# Altium project Controlador_Digital.PrjPcb
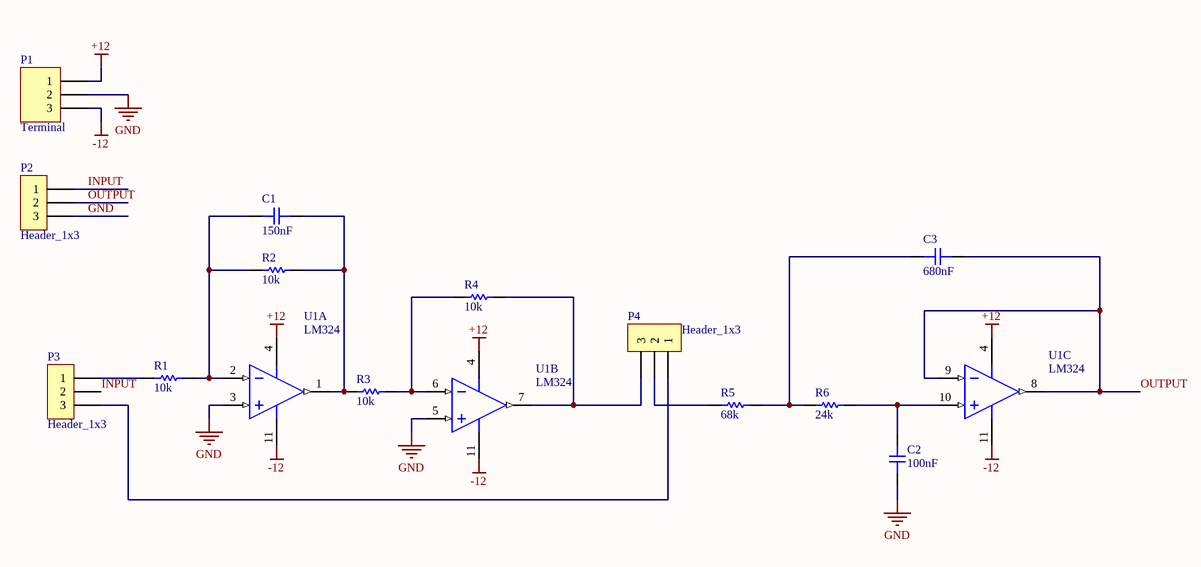
[diagram p0: Controlador_Digital.SchDoc]
1 sheet, 14 parts. Net scope: global (net labels, ports and power ports of the same name join across sheets).
Board file: Controlador_Digital.PcbDoc

## Sheet Controlador_Digital.SchDoc
size A4

### Parts
C1  150nF  [C200-350-150]
C2  100nF  [C300-450-150]
C3  680nF  [C400-550-150]
P1  Terminal  [KRE_3]
P2  Header_1x3  [HDR-M-1x3-2.54mm-180-9.2mm]
P3  Header_1x3  [HDR-M-1x3-2.54mm-180-9.2mm]
P4  Header_1x3  [HDR-M-1x3-2.54mm-180-9.2mm]
R1  10k  [R400-2.0mm]
R2  10k  [R400-2.0mm]
R3  10k  [R400-2.0mm]
R4  10k  [R400-2.0mm]
R5  68k  [R400-2.0mm]
R6  24k  [R400-2.0mm]
U1  LM324  [TI-N14]  (parts A,B,C of 4)

### Nets
+12: P1.1 U1.4(VCC+)
-12: P1.3 U1.11(VCC-)
GND: C2.1 P1.2 P2.3 U1.3(IN1+) U1.5(IN1+)
INPUT: P2.1 P3.2
OUTPUT: C3.1 P2.2 U1.8(OUT1) U1.9(IN1-)
NetC1_1: C1.1 R2.2 R3.1 U1.1(OUT1)
NetC1_2: C1.2 R1.2 R2.1 U1.2(IN1-)
NetC2_2: C2.2 R6.2 U1.10(IN1+)
NetC3_2: C3.2 R5.2 R6.1
NetP3_1: P3.1 R1.1
NetP3_3: P3.3 P4.1
NetP4_2: P4.2 R5.1
NetP4_3: P4.3 R4.2 U1.7(OUT1)
NetR3_2: R3.2 R4.1 U1.6(IN1-)

### Library data of the parts
C1-C3 = Capacitor: Voltage: 100 V; Published: 8-Jun-2000; LatestRevisionDate: 17-Jul-2002; LatestRevisionNote: Re-released for DXP Platform.; PackageReference: RAD-0.3; Publisher: Altium Limited
P1 = KRE_3: Terminal Block 1x3
P2-P4 = Header_1x3: Header, 1 Line, 3 Columns, 3 Pins; LatestRevisionDate: 17-Jul-2002; LatestRevisionNote: Re-released for DXP Platform.; Publisher: Altium Limited
R1-R6 = Resistor: Tolerance: 5%; Power: 1/4 W; Published: 8-Jun-2000; LatestRevisionDate: 17-Jul-2002; LatestRevisionNote: Re-released for DXP Platform.; PackageReference: AXIAL-0.3; Publisher: Altium Limited